# EAGLE board nixie-v-rev-b (EAGLE 9.6.2)
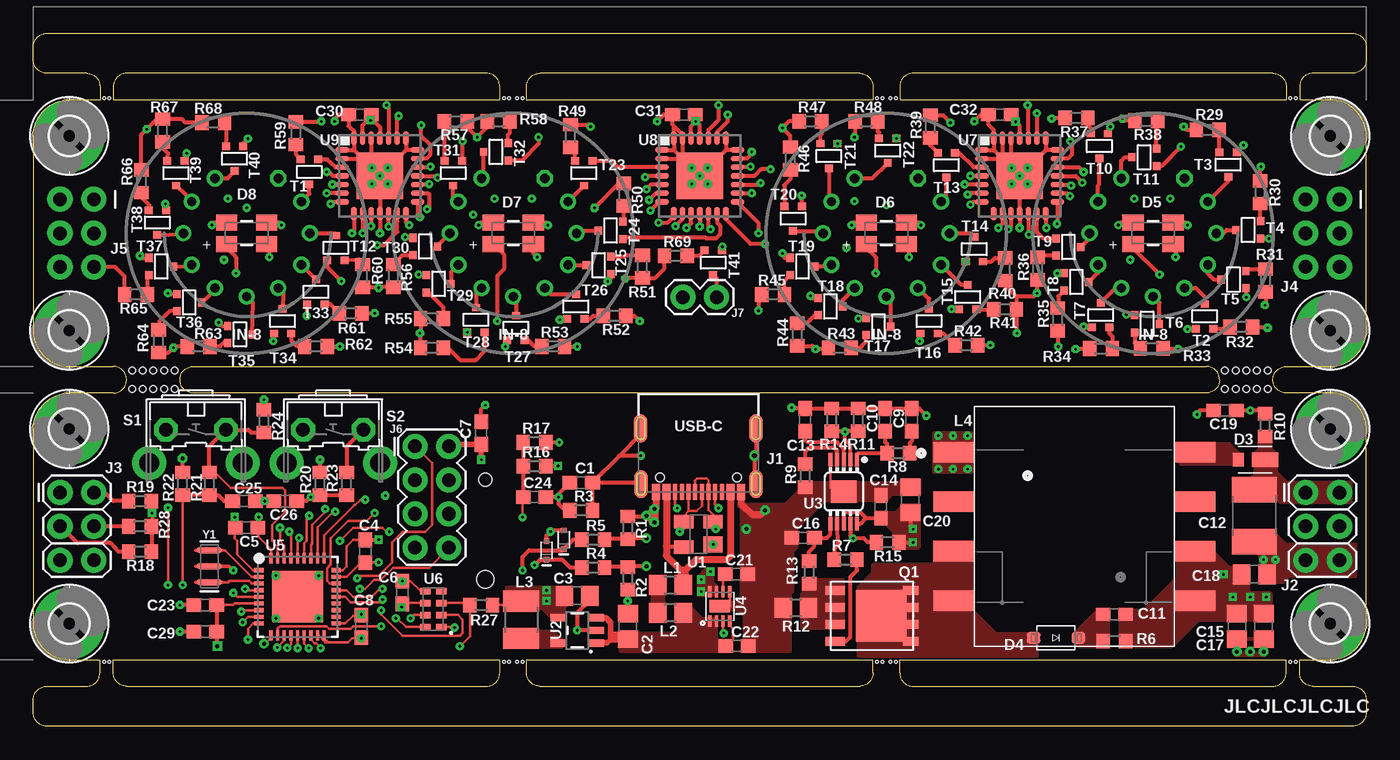
[diagram p5: board, top side]
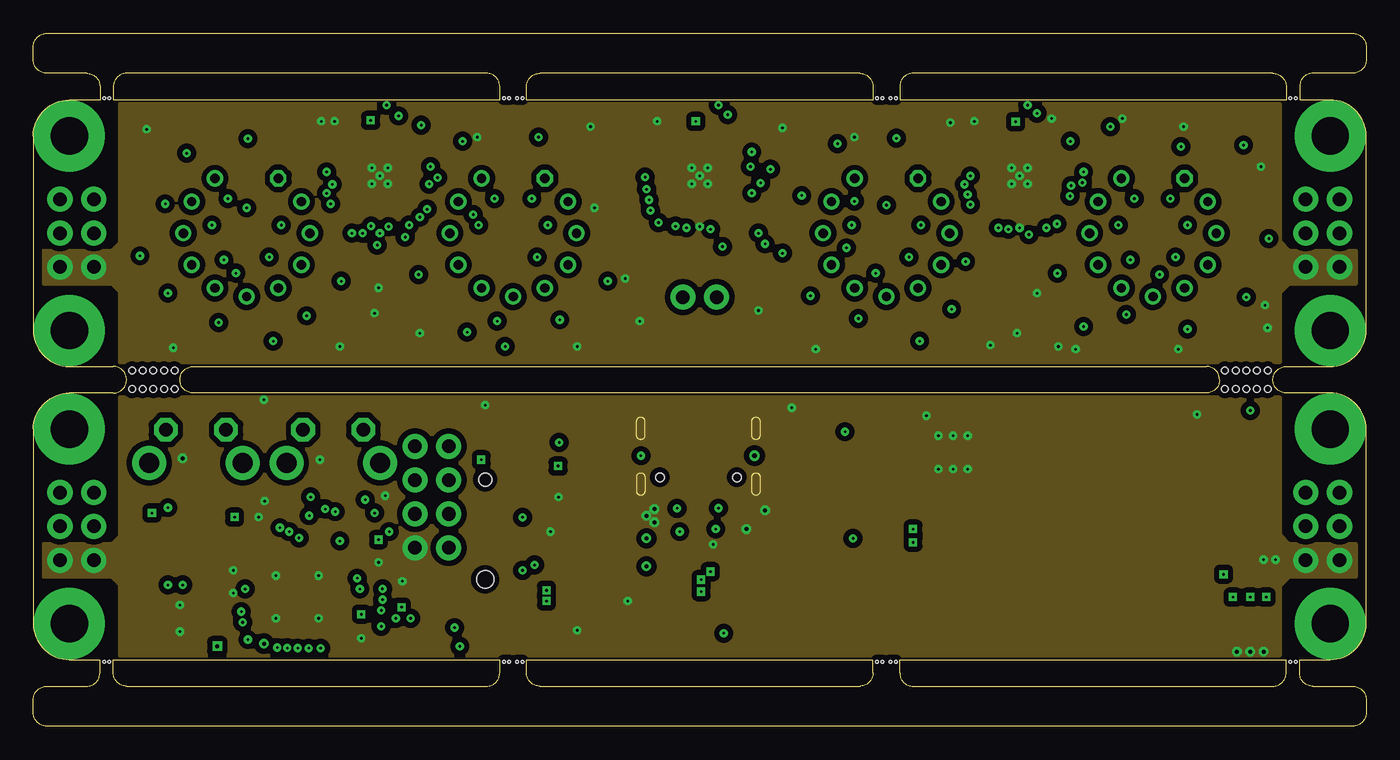
[diagram p6: board, inner layer Route2]
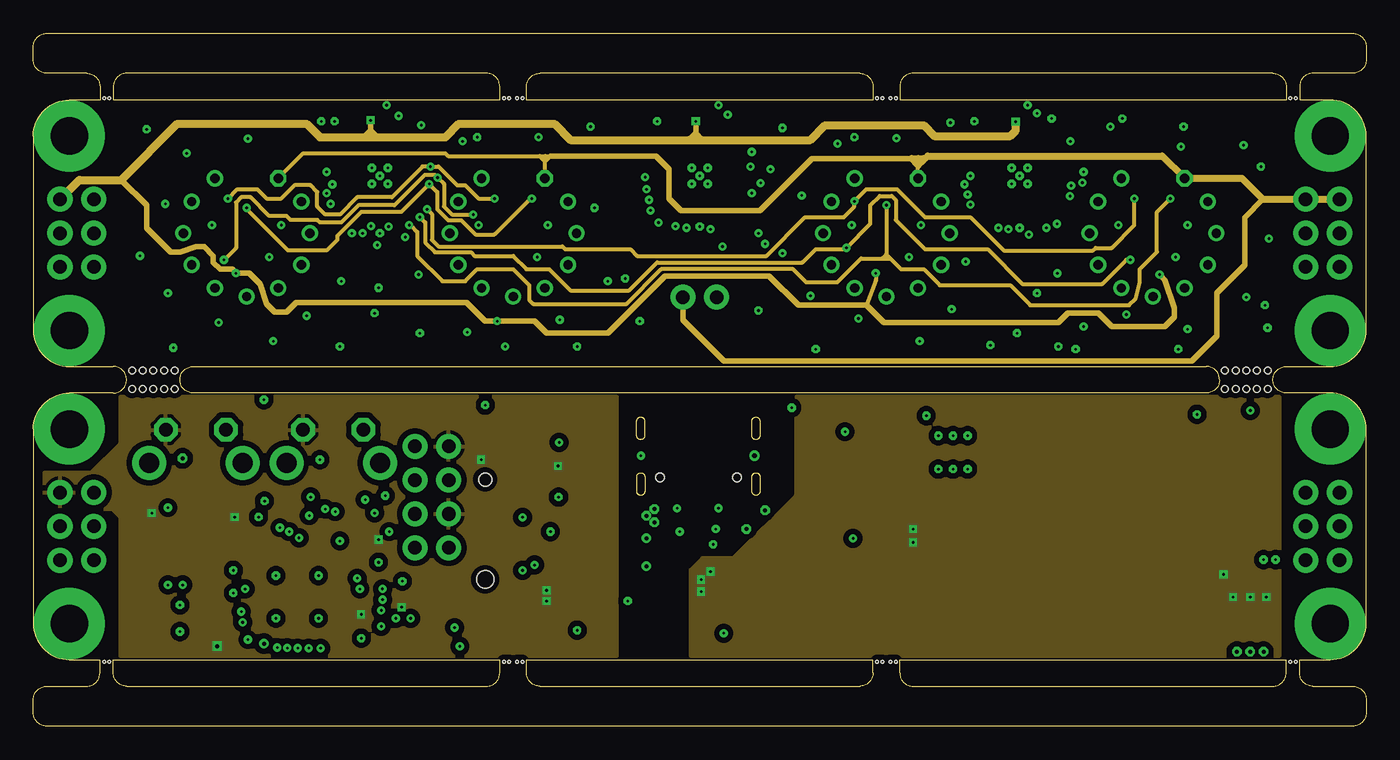
[diagram p7: board, inner layer Route15]
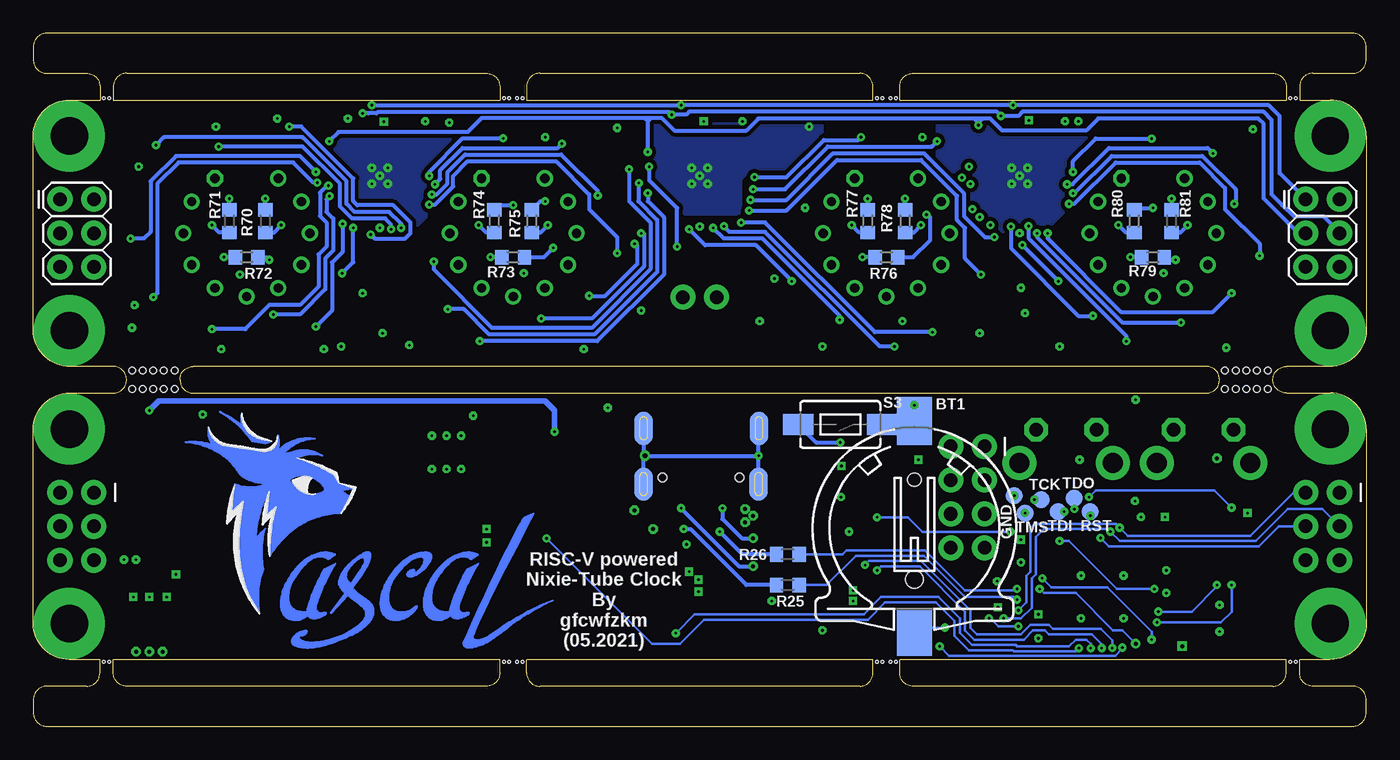
[diagram p8: board, bottom side, seen from below]

Size 100 x 52 mm. Coordinates in mm from the lower left corner, seen from the top.
Outline: 2.7,5 5,5 5,4 arc-90 4,3 1,3 arc90 0,2 0,1 arc90 1,0 99,0 arc90 100,1 100,2 arc90 99,3 96,3 arc-90 95,4 95,5 97.3,5 arc90 100,7.7 100,22.3 arc90 97.3,25 94,25 arc-90 93,26 arc-90 94,27 97.3,27 arc90 100,29.7 100,44.3 arc90 97.3,47 95,47 95,48 arc-90 96,49 99,49 arc90 100,50 100,51 arc90 99,52 1,52 arc90 0,51 0,50 arc90 1,49 4,49 arc-90 5,48 5,47 2.7,47 arc90 0,44.3 0,29.7 arc90 2.7,27 6,27 arc-90 7,26 arc-90 6,25 2.7,25 arc90 0,22.3 0,7.7 arc90 2.7,5
Outline: 6,5 35,5 35,4 arc-90 34,3 7,3 arc-90 6,4 6,5
Outline: 37,5 63,5 63,4 arc-90 62,3 38,3 arc-90 37,4 37,5
Outline: 65,5 94,5 94,4 arc-90 93,3 66,3 arc-90 65,4 65,5
Outline: 88,25 12,25 arc-90 11,26 arc-90 12,27 88,27 arc-90 89,26 arc-90 88,25
Outline: 94,47 65,47 65,48 arc-90 66,49 93,49 arc-90 94,48 94,47
Outline: 63,47 37,47 37,48 arc-90 38,49 62,49 arc-90 63,48 63,47
Outline: 35,47 6,47 6,48 arc-90 7,49 34,49 arc-90 35,48 35,47
Copper layers (1+2*15+16): Top 0.035mm / dielectric 0.2mm / Route2 0.035mm / dielectric 1mm / Route15 0.035mm / dielectric 0.2mm / Bottom 0.035mm
Design rules "jlcpcb_4_layers": minimum track width 5mil, minimum drill 0.2mm, track to track 5mil, track to pad 6mil, pad to pad 6mil, via to via 6mil, smd to smd 6mil, copper to edge 0mil, drill to drill 6mil, minimum pad ring 10mil, minimum via ring 8mil, stop-mask expansion 4mil, vias tented up to drill 0mil, thermal gap 10mil
Holes 0.5 mm at 7.4,25.3 8.2,25.3 9,25.3 9.8,25.3 10.6,25.3 89.4,25.3 90.2,25.3 91,25.3 91.8,25.3 92.6,25.3 89.4,26.7 90.2,26.7 91,26.7 91.8,26.7 92.6,26.7 7.4,26.7 8.2,26.7 9,26.7 9.8,26.7 10.6,26.7
Holes 0.2 mm at 5.3,47.15 5.7,47.15 94.3,47.15 94.7,47.15 63.3,47.15 63.7,47.15 64.3,47.15 64.7,47.15 35.3,47.15 35.7,47.15 36.3,47.15 36.7,47.15 94.7,4.85 94.3,4.85 5.7,4.85 5.3,4.85 36.7,4.85 36.3,4.85 35.7,4.85 35.3,4.85 64.7,4.85 64.3,4.85 63.7,4.85 63.3,4.85

## Footprints (pad centres in the part's own frame; a part is rotated, then mirrored left to right if it is on the bottom)
CH291-1220LF = smd 2.6 x 3.6: + 0,-7.9; - 0,7.9 | hole 1.3: 0,-3.98 | hole 1: 0,3.51
C0603 = smd 1.1 x 1: 1 -0.85,0; 2 0.85,0
C0805 = smd 1.3 x 1.5: 1 -0.95,0; 2 0.95,0
C1812 = smd 1.9 x 3.4: 1 -1.95,0; 2 1.95,0
SOD-523 = smd 0.4 x 0.4: A -0.7,0; C 0.7,0
MICROSMA = smd 0.8 x 1: A 1,0 | smd 2 x 1.1: C -1,0
SOD-123 = smd 1.02 x 0.86: A 1.68,0; C -1.68,0
WL-SFRW_1206_REC = smd 1.6 x 1.2: 1 -1.5,-0.8; 2 -1.5,0.8; 3 1.5,0.8; 4 1.5,-0.8
B1,27 = smd 1.27 x 1.27: TP 0,0
2,8-PAD = drill 2.8 pad 5.334: B2,8 0,0
USB4105-GF-A = smd 0.6 x 1.2: A1 -3.2,4.53; A4 -2.4,4.53; B1 3.2,4.53; B4 2.4,4.53 | smd 0.3 x 1.2: A5 -1.25,4.53; A6 -0.25,4.53; A7 0.25,4.53; A8 1.25,4.53; B5 1.75,4.53; B6 0.75,4.53; B7 -0.75,4.53; B8 -1.75,4.53 | smd 1.4 x 2.5 bottom: SHB1 -4.32,3.93; SHB2 -4.31,-0.25; SHB3 4.32,3.93; SHB4 4.33,-0.25 | smd 1 x 2.1: SHT1 -4.32,3.93; SHT2 -4.31,-0.25; SHT3 4.32,3.93; SHT4 4.33,-0.25 | hole 0.65: -2.89,3.43; 2.89,3.43
2X3 = drill 1.016 pad 1.88: 1 0,0; 2 0,2.54; 3 2.54,0; 4 2.54,2.54; 5 5.08,0; 6 5.08,2.54
2X4 = drill 1.016 pad 1.88: 1 -3.81,-1.27; 2 -3.81,1.27; 3 -1.27,-1.27; 4 -1.27,1.27; 5 1.27,-1.27; 6 1.27,1.27; 7 3.81,-1.27; 8 3.81,1.27
1X02 = drill 1.016 pad 1.88: 1 0,0; 2 2.54,0
R0805 = smd 1.3 x 1.5: 1 -0.95,0; 2 0.95,0
R1210 = smd 1.6 x 2.7: 1 -1.4,0; 2 1.4,0
750032050 = smd 3 x 1.55: 1 -9.075,5.565; 2 -9.075,1.855; 3 -9.075,-1.855; 4 -9.075,-5.565; 5 9.075,-5.565; 6 9.075,-1.855; 7 9.075,1.855; 8 9.075,5.565
IN-8 = drill 0.7: 0 -4.113,-2.375; 1 2.375,-4.113; 2 4.114,-2.375; 3 4.75,0; 4 4.113,2.375; 5 2.375,4.113; 6 0,4.75; 7 -2.375,4.113; 8 -4.113,2.375; 9 -4.75,0 | drill 0.7 octagon: A -2.375,-4.113
SO-08_POWERPAK = smd 1.47 x 0.635: 1 -2.64,1.905; 2 -2.64,0.635; 3 -2.64,-0.635; 4 -2.64,-1.905 | smd 1.22 x 0.635: 5 3.025,-1.905; 6 3.025,-0.635; 7 3.025,0.635; 8 3.025,1.905 | smd 3.81 x 3.91: THERMAL 0.82,0
R0603 = smd 1 x 1.1: 1 -0.85,0; 2 0.85,0
B3F-31XX = drill 1.016 pad 1.778 octagon: 1 -2.261,-1.245; 2 2.261,-1.245 | drill 1.499 pad 2.54: 3 -3.505,1.245; 4 3.505,1.245
TACTILE_SWITCH_SMD_6.0X3.5MM = smd 2.3 x 1.6: 1 -3.15,0; 2 3.15,0
SC70-3-R = smd 0.6 x 0.55: 1 -0.65,-0.925; 2 0.65,-0.925; 3 0,0.925
SOT143B = smd 1.2 x 1.44: 1 -0.75,-1.1 | smd 1 x 1.44: 2 0.95,-1.1; 3 0.95,1.1; 4 -0.95,1.1
TSOT23-5 = smd 0.55 x 1.2: 1 -0.95,-1.4; 2 0,-1.4; 3 0.95,-1.4; 4 0.95,1.4; 5 -0.95,1.4
MSOP10_POWER = smd 0.3 x 1.02: 1 -1,-2.4; 2 -0.5,-2.4; 3 0,-2.4; 4 0.5,-2.4; 5 1,-2.4; 6 1,2.4; 7 0.5,2.4; 8 0,2.4; 9 -0.5,2.4; 10 -1,2.4 | smd 1.88 x 1.68: EP 0,0
WSON-8 = smd 0.8 x 0.25: 1 -1.1,0.75; 2 -1.1,0.25; 3 -1.1,-0.25; 4 -1.1,-0.75; 5 1.1,-0.75; 6 1.1,-0.25; 7 1.1,0.25; 8 1.1,0.75 | smd 0.9 x 1.6: TP 0,0
QFN-36 = smd 0.7 x 0.25: 1 -2.9,2; 2 -2.9,1.5; 3 -2.9,1; 4 -2.9,0.5; 5 -2.9,0; 6 -2.9,-0.5; 7 -2.9,-1; 8 -2.9,-1.5; 9 -2.9,-2; 19 2.9,-2; 20 2.9,-1.5; 21 2.9,-1; 22 2.9,-0.5; 23 2.9,0; 24 2.9,0.5; 25 2.9,1; 26 2.9,1.5; 27 2.9,2 | smd 0.25 x 0.7: 10 -2,-2.9; 11 -1.5,-2.9; 12 -1,-2.9; 13 -0.5,-2.9; 14 0,-2.9; 15 0.5,-2.9; 16 1,-2.9; 17 1.5,-2.9; 18 2,-2.9; 28 2,2.9; 29 1.5,2.9; 30 1,2.9; 31 0.5,2.9; 32 0,2.9; 33 -0.5,2.9; 34 -1,2.9; 35 -1.5,2.9; 36 -2,2.9 | smd 3.9 x 3.9: EP 0,0
RV-3028-C7 = smd 0.5 x 0.8: 1 -1.35,-0.6; 2 -0.45,-0.6; 3 0.45,-0.6; 4 1.35,-0.6; 5 1.35,0.6; 6 0.45,0.6; 7 -0.45,0.6; 8 -1.35,0.6
HVQFN28 = smd 1 x 0.4: 1 -2.825,1.95; 2 -2.825,1.3; 3 -2.825,0.65; 4 -2.825,0; 5 -2.825,-0.65; 6 -2.825,-1.3; 7 -2.825,-1.95; 15 2.825,-1.95; 16 2.825,-1.3; 17 2.825,-0.65; 18 2.825,0; 19 2.825,0.65; 20 2.825,1.3; 21 2.825,1.95 | smd 0.4 x 1: 8 -1.95,-2.825; 9 -1.3,-2.825; 10 -0.65,-2.825; 11 0,-2.825; 12 0.65,-2.825; 13 1.3,-2.825; 14 1.95,-2.825; 22 1.95,2.825; 23 1.3,2.825; 24 0.65,2.825; 25 0,2.825; 26 -0.65,2.825; 27 -1.3,2.825; 28 -1.95,2.825 | smd 3.5 x 3.5: TH 0,0
RESONATOR-SMD-3.2X1.3 = smd 0.45 x 1.905: 1 -1.2,0; 2 0,0; 3 1.2,0

## Placement (x,y rotation side)
BT1  3v 1220 Battery  [CH291-1220LF]  33.9,15 0 bottom
C1  100nF  [C0603]  41.11,18.29 180 top
C2  4.7uF  [C0805]  44.6,7.5 90 top
C3  10uF  [C0805]  40.8,9.8 0 top
C4  1uF  [C0603]  24.91,13.13 270 top
C5  1uF  [C0603]  16,14.9 0 top
C6  1uF  [C0603]  27.69,10.03 90 top
C7  1uF  [C0603]  33.6,22 90 top
C8  1uF  [C0603]  24.6,7.5 270 top
C9  22nF  [C0603]  65.9,23 90 top
C10  100pF  [C0603]  63.9,23 90 top
C11  2.2nF  [C0603]  81.1,8.4 180 top
C12  470nF  [C1812]  91.6,15.8 270 top
C13  22nF  [C0603]  57.9,23 90 top
C14  1uF  [C0603]  63.59,16.47 90 top
C15  22uF  [C0805]  90.3,7.5 270 top
C16  3.3nF  [C0603]  57.75,14.14 180 top
C17  22uF  [C0805]  92.3,7.5 270 top
C18  22uF  [C0805]  91.6,11.4 0 top
C19  6.8pF  [C0603]  89.4,23.7 180 top
C20  22uF  [C0805]  65.8,17 90 top
C21  680pF  [C0603]  52.75,11.41 0 top
C22  1uF  [C0603]  52.79,6.02 0 top
C23  10nF  [C0603]  12.9,9.1 180 top
C24  100nF  [C0603]  37.6,17.2 0 top
C25  100nF  [C0603]  15.8,16.9 0 top
C26  100nF  [C0603]  18.9,16.9 180 top
C29  1uF  [C0603]  12.9,7.1 180 top
C30  1uF  [C0603]  24.5,45.9 180 top
C31  1uF  [C0603]  48.8,45.9 180 top
C32  1uF  [C0603]  72.5,45.9 180 top
D1  3V  [SOD-523]  39.8,14 270 top
D2  3V  [SOD-523]  38.5,13.2 270 top
D3  ESH1JMRSG  [MICROSMA]  91.4,19.99 180 top
D4  MBR0520LT1G  [SOD-123]  76.73,6.63 180 top
D5  [WL-SFRW_1206_REC]  84,37 0 top
D6  [WL-SFRW_1206_REC]  64,37 0 top
D7  [WL-SFRW_1206_REC]  36,37 0 top
D8  [WL-SFRW_1206_REC]  16,37 0 top
GND  TPB1,27  [B1,27]  26.4,17.3 0 bottom
H1  MOUNT-PAD-ROUND2.8  [2,8-PAD]  97.3,22.3 0 top
H2  MOUNT-PAD-ROUND2.8  [2,8-PAD]  97.3,7.7 0 top
H3  MOUNT-PAD-ROUND2.8  [2,8-PAD]  97.3,44.3 0 top
H4  MOUNT-PAD-ROUND2.8  [2,8-PAD]  97.3,29.7 0 top
H5  MOUNT-PAD-ROUND2.8  [2,8-PAD]  2.7,7.7 0 top
H6  MOUNT-PAD-ROUND2.8  [2,8-PAD]  2.7,22.3 0 top
H7  MOUNT-PAD-ROUND2.8  [2,8-PAD]  2.7,44.3 0 top
H8  MOUNT-PAD-ROUND2.8  [2,8-PAD]  2.7,29.7 0 top
J1  USB41XX-GF-AMIXED  [USB4105-GF-A]  49.9,22.1 180 top
J2  ToUpperPCB  [2X3]  95.46,17.54 270 top
J3  ToUpperPCB  [2X3]  2,17.54 270 top
J4  FromLowerPCB  [2X3]  98,39.54 270 bottom
J5  FromLowerPCB  [2X3]  4.54,39.54 270 bottom
J6  ESP-01  [2X4]  29.9,17.2 270 top
J7  [1X02]  48.73,32.2 0 top
L1  Ih 750mA  [R0805]  47.8,10.6 0 top
L2  f-bead  [R0805]  47.8,8.5 180 top
L3  4.7uH  [R1210]  36.6,8 270 top
L4  750032050  [750032050]  78.1,15 0 top
N1  Single Minutes  [IN-8]  84,37 180 top
N2  Tens Minutes  [IN-8]  64,37 180 top
N3  Singe Hours  [IN-8]  36,37 180 top
N4  Tens Hours  [IN-8]  16,37 180 top
Q1  SIR170DP  [SO-08_POWERPAK]  62.8,8.28 0 top
R1  5.1k  [R0603]  44.6,14.9 270 top
R2  5.1k  [R0603]  44.6,11.1 90 top
R3  10k  [R0603]  41.11,16.2 0 top
R4  100  [R0603]  42,11.9 180 top
R5  100  [R0603]  42,14 180 top
R6  10k  [R0603]  81.1,6.4 0 top
R7  10  [R0603]  60.94,12.5 0 top
R8  10k  [R0603]  64.9,20.5 180 top
R9  30.9k  [R0603]  57.9,18.8 90 top
R10  1.05M  [R0603]  92.4,22.6 270 top
R11  10.5k  [R0603]  61.9,23 270 top
R12  20m  [R0805]  57.2,8.9 0 top
R13  10  [R0603]  58.2,11.55 270 top
R14  180k  [R0603]  59.9,23 270 top
R15  10k  [R0603]  64.1,13.8 0 top
R16  10k  [R0603]  37.6,19.51 0 top
R17  330  [R0603]  37.59,21.3 180 top
R18  3.3k  [R0603]  8,13.1 0 top
R19  3.3k  [R0603]  8,16.9 0 top
R20  10k  [R0603]  21.5,18.2 270 top
R21  330  [R0603]  13.2,18.2 90 top
R22  10k  [R0603]  11.2,18.2 270 top
R23  330  [R0603]  23.5,18.2 90 top
R24  100k  [R0603]  17.3,22.9 270 top
R25  22  [R0603]  43.4,10.6 180 bottom
R26  22  [R0603]  43.4,12.9 180 bottom
R27  3.3k  [R0603]  33.6,9.1 0 top
R28  3.3k  [R0603]  8,15 0 top
R29  1.3k  [R0603]  88.11,44.74 0 top
R30  1.3k  [R0603]  92.04,40.07 270 top
R31  1.3k  [R0603]  92.46,33.45 90 top
R32  1.3k  [R0603]  90.63,29.96 180 top
R33  1.3k  [R0603]  83.91,28.36 180 top
R34  1.3k  [R0603]  80.11,28.34 0 top
R35  1.3k  [R0603]  76.86,30.53 90 top
R36  1.3k  [R0603]  75.36,34.35 90 top
R37  1.3k  [R0603]  78.27,45.64 0 top
R38  1.3k  [R0603]  83.49,45.44 0 top
R39  1.3k  [R0603]  67.3,45 270 top
R40  1.3k  [R0603]  72.9,34.3 90 top
R41  1.3k  [R0603]  72.9,31.3 180 top
R42  1.3k  [R0603]  70,28.6 180 top
R43  1.3k  [R0603]  60.5,28.4 0 top
R44  1.3k  [R0603]  57.3,29.4 90 top
R45  1.3k  [R0603]  55.5,32.4 0 top
R46  1.3k  [R0603]  56.8,42.6 270 top
R47  1.3k  [R0603]  58.3,45.4 0 top
R48  1.3k  [R0603]  62.5,45.4 0 top
R49  1.3k  [R0603]  40.3,44.3 270 top
R50  1.3k  [R0603]  44.3,39.9 270 top
R51  1.3k  [R0603]  45.7,34.5 90 top
R52  1.3k  [R0603]  43.6,30.8 180 top
R53  1.3k  [R0603]  39,28.5 180 top
R54  1.3k  [R0603]  29.9,28.4 0 top
R55  1.3k  [R0603]  29.9,30.6 0 top
R56  1.3k  [R0603]  27,33.8 90 top
R57  1.3k  [R0603]  31.7,45.4 180 top
R58  1.3k  [R0603]  34.9,45.4 0 top
R59  1.3k  [R0603]  19.7,44.5 270 top
R60  1.3k  [R0603]  24.7,33.8 90 top
R61  1.3k  [R0603]  23.8,31 180 top
R62  1.3k  [R0603]  21.2,28.5 180 top
R63  1.3k  [R0603]  12.4,28.5 0 top
R64  1.3k  [R0603]  9.4,28.9 90 top
R65  1.3k  [R0603]  7.7,32.4 0 top
R66  1.3k  [R0603]  8.1,40.9 270 top
R67  1.3k  [R0603]  9.7,44.7 270 top
R68  1.3k  [R0603]  13.5,45.3 0 top
R69  5.4k  [R0603]  48.2,35.3 0 top
R70  10  [R0603]  82.6,37.9 90 bottom
R71  191  [R0603]  85.3,37.9 90 bottom
R72  115  [R0603]  84,35.2 0 bottom
R73  115  [R0603]  64,35.2 0 bottom
R74  191  [R0603]  65.4,37.9 90 bottom
R75  10  [R0603]  62.6,37.9 90 bottom
R76  115  [R0603]  36,35.2 0 bottom
R77  191  [R0603]  37.4,37.9 90 bottom
R78  10  [R0603]  34.6,37.9 90 bottom
R79  115  [R0603]  16,35.2 0 bottom
R80  191  [R0603]  17.4,37.9 90 bottom
R81  10  [R0603]  14.6,37.9 90 bottom
RST  TPB1,27  [B1,27]  20.7,16.1 0 bottom
S1  Set  [B3F-31XX]  12.2,21 180 top
S2  Count  [B3F-31XX]  22.5,21 180 top
S3  Reset  [TACTILE_SWITCH_SMD_6.0X3.5MM]  39.46,22.64 180 bottom
T1  MSD42WT1G  [SC70-3-R]  20.7,41.6 180 top
T2  MSD42WT1G  [SC70-3-R]  87.88,30.76 0 top
T3  MSD42WT1G  [SC70-3-R]  89.64,42.14 180 top
T4  MSD42WT1G  [SC70-3-R]  91.14,37.24 90 top
T5  MSD42WT1G  [SC70-3-R]  90.04,33.52 90 top
T6  MSD42WT1G  [SC70-3-R]  83.56,30.2 270 top
T7  MSD42WT1G  [SC70-3-R]  80.08,30.86 0 top
T8  MSD42WT1G  [SC70-3-R]  78.26,33.34 270 top
T9  MSD42WT1G  [SC70-3-R]  77.66,35.96 270 top
T10  MSD42WT1G  [SC70-3-R]  79.98,43.54 180 top
T11  MSD42WT1G  [SC70-3-R]  83.34,42.7 90 top
T12  MSD42WT1G  [SC70-3-R]  22.7,35.9 0 top
T13  MSD42WT1G  [SC70-3-R]  68.5,42.1 180 top
T14  MSD42WT1G  [SC70-3-R]  70.6,35.8 0 top
T15  MSD42WT1G  [SC70-3-R]  70.1,32.2 0 top
T16  MSD42WT1G  [SC70-3-R]  67.2,30.4 0 top
T17  MSD42WT1G  [SC70-3-R]  63.4,30 270 top
T18  MSD42WT1G  [SC70-3-R]  59.8,31.5 270 top
T19  MSD42WT1G  [SC70-3-R]  57.7,34.5 270 top
T20  MSD42WT1G  [SC70-3-R]  57,38.1 180 top
T21  MSD42WT1G  [SC70-3-R]  59.69,42.79 180 top
T22  MSD42WT1G  [SC70-3-R]  64.1,43.2 180 top
T23  MSD42WT1G  [SC70-3-R]  41.3,41.5 180 top
T24  MSD42WT1G  [SC70-3-R]  43.3,37.2 90 top
T25  MSD42WT1G  [SC70-3-R]  42.4,34.6 90 top
T26  MSD42WT1G  [SC70-3-R]  40.7,31.5 0 top
T27  MSD42WT1G  [SC70-3-R]  36.2,29.9 0 top
T28  MSD42WT1G  [SC70-3-R]  33.2,30.5 0 top
T29  MSD42WT1G  [SC70-3-R]  30.4,33.2 270 top
T30  MSD42WT1G  [SC70-3-R]  29.4,36 270 top
T31  MSD42WT1G  [SC70-3-R]  31.5,41.5 180 top
T32  MSD42WT1G  [SC70-3-R]  34.7,43.1 90 top
T33  MSD42WT1G  [SC70-3-R]  21.2,32.6 0 top
T34  MSD42WT1G  [SC70-3-R]  18.7,30.4 0 top
T35  MSD42WT1G  [SC70-3-R]  15.5,29.4 270 top
T36  MSD42WT1G  [SC70-3-R]  11.7,31.8 270 top
T37  MSD42WT1G  [SC70-3-R]  9.6,34.5 270 top
T38  MSD42WT1G  [SC70-3-R]  9.3,37.8 180 top
T39  MSD42WT1G  [SC70-3-R]  10.7,41.5 180 top
T40  MSD42WT1G  [SC70-3-R]  15.1,42.6 180 top
T41  MSD42WT1G  [SC70-3-R]  51,34.8 180 top
TCK  TPB1,27  [B1,27]  24.4,17 0 bottom
TDI  TPB1,27  [B1,27]  23.1,16.1 0 bottom
TDO  TPB1,27  [B1,27]  21.9,17.1 0 bottom
TMS  TPB1,27  [B1,27]  25.6,16 0 bottom
U1  PRTR5V0U2X  [SOT143B]  49.9,14.4 90 top
U2  MCP1603  [TSOT23-5]  40.8,7.2 90 top
U3  LT3757A_MSOP  [MSOP10_POWER]  60.8,17.6 180 top
U4  TPS22965  [WSON-8]  51.5,9 90 top
U5  GD32VF103T  [QFN-36]  19.83,9.71 0 top
U6  RV-3032-C7  [RV-3028-C7]  30,8.8 90 top
U7  PCA9685BS  [HVQFN28]  74,41.3 0 top
U8  PCA9685BS  [HVQFN28]  50,41.3 0 top
U9  PCA9685BS  [HVQFN28]  26,41.3 0 top
U$1  LOGO_PASCAL_GESELL30MM  [LOGO_30MM]  90.71,2.77 0 bottom
U$2  LOGO_PASCAL_GESELLEMPTY  [EMPTY]  48.89,20.81 0 top
U$3  LOGO_PASCAL_GESELLEMPTY  [EMPTY]  47.25,21.71 0 top
U$4  LOGO_PASCAL_GESELLEMPTY  [EMPTY]  48.31,21.21 0 top
U$5  LOGO_PASCAL_GESELLEMPTY  [EMPTY]  47.77,22.51 0 top
Y1  8MHz  [RESONATOR-SMD-3.2X1.3]  13.2,12 270 top

## Tracks (layer width: path | path; a pad name or v marks a point on that pad's centre or on a via)
00  (via drill 0.2)
  Top 0.305: U7.9 72.7,37.7 v72.4,37.4 | v90.8,43.6 90.8,43.58 T3.1
  Bottom 0.305: v72.4,37.4 72.4,37.7 73.3,38.6 75.9,38.6 76.5,39.2 76.5,40.9 79.8,44.2 90.2,44.2 v90.8,43.6
01  (via drill 0.2)
  Top 0.305: U7.10 73.35,37.49 v73.16,37.3 | v86.1,43.5 84.65,42.05 T11.1
  Bottom 0.305: v73.16,37.3 73.16,37.66 73.6,38.1 76.1,38.1 77,39 77,40.7 79.8,43.5 v86.1,43.5
02  (via drill 0.2)
  Top 0.305: U7.12 74.65,36.94 v74.69,36.9 | v80.8,45 80.63,44.83 T10.1
  Bottom 0.305: v74.69,36.9 74.39,36.6 72.1,36.6 71.7,37 71.7,37.8 73,39.1 75.69,39.1 76,39.41 76,41.1 79.9,45 v80.8,45
03
  Top 0.305: T9.1 75.79,36.61 75.3,37.1 U7.13
04  (via drill 0.2)
  Top 0.305: U7.14 75.95,37.45 v76,37.4 | T8.1 v76.83,33.99
  Bottom 0.305: v76.83,33.99 76,34.83 v76,37.4
05  (via drill 0.2)
  Top 0.305: U7.15 76.83,37.73 v76.8,37.7 | v78.8,30 78.86,29.93 T7.1
  Bottom 0.305: v76.8,37.7 76.8,35.6 77.6,34.8 77.6,31.2 v78.8,30
06  (via drill 0.2)
  Top 0.305: U7.16 77.55,40 v77.78,39.78 | v82,30.9 82.05,30.85 T6.1
  Bottom 0.305: v77.78,39.78 78,39.55 78,38.6 77.5,38.1 77.5,35.7 78.1,35.1 78.1,32.8 80,30.9 v82,30.9
07  (via drill 0.2)
  Top 0.305: U7.17 77.78,40.65 v77.86,40.56 | v86.6,29.8 86.64,29.84 T2.1
  Bottom 0.305: v77.86,40.56 77.96,40.56 78.5,40.03 78.5,38.3 78,37.8 78,36 78.6,35.4 78.6,33 79.99,31.61 82.29,31.61 84.1,29.8 v86.6,29.8
08  (via drill 0.2)
  Top 0.305: U7.18 78.2,41.3 v78.7,40.8 | v91,32.2 91,32.84 T5.1
  Bottom 0.305: v78.7,40.8 79,40.8 80.5,42.3 89.1,42.3 90.7,40.7 90.7,32.5 v91,32.2
09  (via drill 0.2)
  Top 0.305: U7.19 78.45,41.95 v78.8,41.6 | v92.7,36.6 v92.69,36.59 T4.1
  Bottom 0.305: v78.8,41.6 80,42.8 89.3,42.8 91.2,40.9 91.2,37.1 91.7,36.6 v92.7,36.6
10
  Top 0.305: U7.3 70.55,41.95 69.47,43.02 T13.1
11  (via drill 0.2)
  Top 0.305: U7.4 v70.3,41.3
  Bottom 0.305: v70.3,41.3 70.3,41.6 67.78,44.12 T22.1
  other vias: 64.75,44.12
12  (via drill 0.2)
  Top 0.305: U7.5 69.88,40.65 v69.86,40.66
  Bottom 0.305: v69.86,40.66 69.46,41.06 69.46,41.74 67.8,43.4 60.66,43.4 v60.34,43.72
13  (via drill 0.2)
  Top 0.305: U7.6 70.19,40 v70.1,39.91 | T20.1 v57.65,39.83
  Bottom 0.305: v70.1,39.91 69.76,39.91 68.93,40.73 68.93,41.57 67.6,42.9 60.4,42.9 57.65,40.15 v57.65,39.83
14  (via drill 0.2)
  Top 0.305: U7.7 70.5,39.35 v70.3,39.15 | v56.2,35.5 56.2,35.33 56.38,35.15 T19.1
  Bottom 0.305: v70.3,39.15 69.85,39.15 68.5,40.5 68.5,41.3 67.4,42.4 60.8,42.4 58.3,39.9 58.3,38.8 56.2,36.7 v56.2,35.5
15  (via drill 0.2)
  Top 0.305: U8.14 51.95,38.05 53.8,36.2 v54.9,36.2 | v58.3,32.3 58.45,32.15 T18.1
  Bottom 0.305: v54.9,36.2 54.7,36 54.7,34.7 57.1,32.3 v58.3,32.3
16  (via drill 0.2)
  Top 0.305: v61.9,30.6 61.95,30.65 T17.1 | U8.15 54.4,37.77 v54.4,37
  Bottom 0.305: v54.4,37 54.2,37 54.2,34.5 58.1,30.6 v61.9,30.6
17  (via drill 0.2)
  Top 0.305: U8.16 v53.9,40 v53.9,40.01 | v66.5,28.9 66.55,28.95 T16.1
  Bottom 0.305: v53.9,40.01 53.9,39.4 52.7,38.2 52.7,33.9 57.7,28.9 v66.5,28.9
18  (via drill 0.2)
  Top 0.305: U8.17 54.45,40.65 v54.56,40.76 | v68.9,31.3 69.42,31.3 T15.1
  Bottom 0.305: v54.56,40.76 54.6,40.73 54.6,39.4 53.2,38 53.2,34.1 57.9,29.4 65.8,29.4 67.7,31.3 v68.9,31.3
19  (via drill 0.2)
  Top 0.305: v55.3,41.8 54.6,41.8 54.1,41.3 U8.18
  Bottom 0.305: v55.3,41.8 55.3,39.4 53.7,37.8 53.7,34.3 58.1,29.9 65.58,29.9 69.95,34.27 T14.1
  other vias: 69.95,34.88
20
  Top 0.305: U8.3 43.85,41.95 43.38,42.42 T23.1
21  (via drill 0.2)
  Top 0.305: U8.4 46,41.3 v45.9,41.2 | v37.9,44.2 37.9,43.7 36.65,42.45 T32.1
  Bottom 0.305: v45.9,41.2 43.5,41.2 40.7,44 38.1,44 v37.9,44.2
22  (via drill 0.2)
  Top 0.305: U8.5 46.35,40.65 v46,40.3 | v32.2,43.9 32.15,43.85 T31.1
  Bottom 0.305: v46,40.3 43.6,40.3 40.4,43.5 32.6,43.5 v32.2,43.9
23  (via drill 0.2)
  Top 0.305: U8.6 46.7,40 v46.2,39.5 | v27.9,36.7 27.95,36.65 T30.1
  Bottom 0.305: v46.2,39.5 43.5,39.5 40,43 33.2,43 30.15,39.95 30.15,38.25 28.6,36.7 v27.9,36.7
24  (via drill 0.2)
  Top 0.305: U8.7 46.95,39.35 v46.3,38.7 | v28.9,33.9 28.95,33.85 T29.1
  Bottom 0.305: v46.3,38.7 43.5,38.7 39.7,42.5 33.4,42.5 30.7,39.8 30.7,38 30.1,37.4 30.1,35.1 v28.9,33.9
25  (via drill 0.2)
  Top 0.305: v46.9,37.8 47.6,37.8 48.05,38.25 U8.8
  Bottom 0.305: T28.1 36.88,29.57 45.1,37.8 v46.9,37.8
  other vias: 32.55,29.57
26  (via drill 0.2)
  Top 0.305: T27.1 35.55,28.65 v35.4,28.5 | v48.18,37.52 48.7,38.04 U8.9
  Bottom 0.305: v35.4,28.5 36.5,28.5 45.1,37.1 47.76,37.1 v48.18,37.52
27  (via drill 0.2)
  Top 0.305: T26.1 39.98,30.5 v39.5,30.5 | v49,37.4 49.35,37.75 U8.10
  Bottom 0.305: v39.5,30.5 39.5,30.8 45.3,36.6 48.2,36.6 v49,37.4
28  (via drill 0.2)
  Top 0.305: T25.1 43.33,33.62 v43.1,33.4 | v50.8,37.3 50.65,37.45 U8.12
  Bottom 0.305: v43.1,33.4 45.8,36.1 49.6,36.1 v50.8,37.3
29
  Top 0.305: U8.13 51.3,37.8 51.5,37.6 51.5,36.9 51.2,36.6 50.5,36.6 50.4,36.7 44.38,36.7 T24.1
30
  Top 0.305: U9.3 22.66,41.95 22.05,42.52 T1.1
31  (via drill 0.2)
  Top 0.305: U9.4 22.48,41.3 22.18,41.6 v22,41.6 | v16.1,44.1 15.75,43.75 T40.1
  Bottom 0.305: v22,41.6 22,42.4 20.3,44.1 v16.1,44.1
32  (via drill 0.2)
  Top 0.305: U9.5 v22.45,40.65 v22.44,40.66 | v11.5,43 11.35,42.85 T39.1
  Bottom 0.305: v22.44,40.66 22.04,40.66 19.3,43.4 11.9,43.4 v11.5,43
33  (via drill 0.2)
  Top 0.305: U9.6 v22,40 | v9.9,39.2 9.95,39.15 T38.1
  Bottom 0.305: v22,40 21.9,40 19.1,42.8 12.3,42.8 9.8,40.3 9.8,39.3 v9.9,39.2
34  (via drill 0.2)
  Top 0.305: U9.7 22.45,39.35 v22.3,39.2 | v8,35.3 8.15,35.15 T37.1
  Bottom 0.305: v22.3,39.2 21.9,39.2 18.8,42.3 12.5,42.3 10.6,40.4 10.6,38.8 8,36.2 v8,35.3
35  (via drill 0.2)
  Top 0.305: U9.8 24.05,37.15 v23.9,37 | v10.1,32.5 10.15,32.45 T36.1
  Bottom 0.305: v23.9,37 23.9,36.6 18.4,31.1 11.5,31.1 v10.1,32.5
36  (via drill 0.2)
  Top 0.305: U9.9 v24.7,37 | v13.9,30.3 14.15,30.05 T35.1
  Bottom 0.305: v24.7,37 24.7,36.7 18.3,30.3 v13.9,30.3
37  (via drill 0.2)
  Top 0.305: U9.10 v25.35,37.55 v25.34,37.54 | v18,28.9 18.05,28.95 T34.1
  Bottom 0.305: v25.34,37.54 25.34,36.64 18,29.3 v18,28.9
38  (via drill 0.2)
  Top 0.305: v20.5,30.8 20.55,30.85 T33.1 | v26.65,37.5 U9.12
  Bottom 0.305: v26.65,37.5 26.65,35.9 21.6,30.8 v20.5,30.8
39  (via drill 0.2)
  Top 0.305: T12.1 22.05,34.45 v23.1,33.4 | v25.8,36.1 26.3,36.1 27.31,37.11 27.31,37.89 27.3,37.9 U9.13
  Bottom 0.305: v23.1,33.4 v25.8,36.1
!OE  (via drill 0.2)
  Top 0.203: U5.32 19.83,14.03 v19.94,14.14
  Top 0.305: R28.1 J3.4
  Bottom 0.203: v19.94,14.14 19.3,13.5 8.04,13.5 6.54,15 J3.4
+3V3  (via drill 0.2, 0.3)
  Top 0.203: U5.1 16.49,11.71 15.3,12.9 15.3,13.9 15.1,14.1 15.1,14.85 C5.1 | U5.6 15.11,9.21 15,9.1 C23.1 | U5.19 23.41,7.71 24,8.3 C8.1 | U5.27 23.21,11.71 23.5,12 23.5,13.5 23.98,13.98 C4.1 | U6.6 27.76,9.25 C6.1 27.69,8.99 v27.62,8.93 | R27.2 36.3,9.1 L3.1
  Top 0.305: C5.1 15.15,15.65 v15.1,15.7 | C23.1 C29.1 13.75,6.05 v13.8,6 | C8.1 v24.6,8.4 | C4.1 24.93,14 v25.9,14 | R19.2 8.9,16.85 v8.9,16 8.9,15.05 R28.2 | R28.2 8.85,15.05 | R18.2 8.9,13.15 8.9,14.95 R28.2 | R16.2 38.46,19.53 v39.37,19.53
  Top 0.406: v33.6,20 C7.1 31.31,21.15 J6.2
  other vias: 38.5,9.4 38.5,10.2
  pour Top (no thermals): 39.8,8.1 39.8,8.9 40.1,9.2 40.1,10.4 35.5,10.4 35.5,8.9 38.2,8.9 39,8.1
  pour Route15 (isolate 0.406): 6.5,24.7 6.5,21.2 4.3,19 0.8,19 0.8,16.3 5.9,16.3 6.5,15.7 6.5,5.3 43.8,5.3 43.8,24.7
+5V
  Top 0.203: U4.4 52.25,7.55 52.5,7.3 52.5,6.58 C22.1
  Top 0.406: U2.3 42.95,8.15 43.3,7.8 43.3,6.9 | U2.1 43.05,6.25 43.3,6.5 | 44.55,6.5 C2.1 44.58,6.57 | 43.3,6.9 43.3,6.5 | 43.3,6.9 44.2,6.9 44.58,6.57 | 43.3,6.5 44.58,6.5 44.58,6.57
  pour Top (no thermals): 44,7 48,7 48.3,7.3 48.3,9 49.3,9 50.2,8.1 51.26,8.1 51.26,6.68 51.41,6.5 52.3,6.5 52.3,5.6 44,5.6
+170VDC
  Route15 0.305: N4.A 20.26,43 30.9,43 31.1,42.8 38,42.8 | N2.A 66.38,42.1 | N3.A 38.38,42.38 | 38.38,42.38 38.8,42.8 38.4,42.8 | 38,42.8 38.4,42.8 | 38.38,42.38 38.38,42.77 38.4,42.8 | 38.38,42.38 38,42.75 38,42.8
  Route15 0.406: 38.8,42.8 46.7,42.8 47.7,41.8 47.7,39.6 48.6,38.7 54.5,38.7 58.4,42.6 65.9,42.6 | 92.26,39.54 90.9,38.18 90.9,34.6 88.8,32.5 88.8,29.3 86.9,27.4 51.8,27.4 48.73,30.47 J7.1
  Route15 0.508: 66.4,42.6 65.9,42.6 66.38,42.12 | 66.4,42.6 66.8,42.6 | 66.8,42.6 66.9,42.6 67.1,42.8 84.69,42.8 N1.A 90.69,41.11 92.26,39.54 J4.2 J4.1 | 66.38,42.12 66.38,42.58 66.4,42.6 | 66.38,42.12 66.38,42.1 66.8,42.52 66.8,42.6
AGND  (via drill 0.2)
  Top 0.305: 24.7,42.6 U9.2 22.9,42.6 | 24.7,42.6 25.1,42.2 | U9.1 24.05,43.25 | 24.05,43.25 24.7,42.6 | 24.05,43.25 U9.28 24.05,44.65 23.65,45.05 C30.2 22.95,45.9 22.6,45.55 v22.6,45.4 | U9.26 25.35,42.45 25.1,42.2 | U9.21 27.95,43.25 | 27.95,43.25 v26.6,41.9 U9.TH | 27.95,43.25 U9.22 27.95,44.35 | v26,37 U9.11 U9.TH | 48.05,45.05 48.7,44.4 U8.27 48.7,42.7 48.65,42.65 | 48.05,45.05 U8.28 48.05,43.25 | 48.05,45.05 47.95,45.15 C31.2 47.31,45.9 v46.8,45.39 | U8.11 v50,37.5 | U8.1 48.05,43.25 | 48.05,43.25 48.65,42.65 | 48.65,42.65 U8.TH 51.95,43.25 | U8.21 51.95,43.25 | U8.22 51.95,43.25 | U8.2 48.6,42.6 48.65,42.65 | v74,37.4 U7.11 U7.TH | v70.6,45.4 71.1,45.9 C32.2 71.65,45.15 72.05,44.75 U7.28 72.05,43.25 | U7.1 72.05,43.25 | 72.05,43.25 72.6,42.7 | 72.6,42.7 v73.4,41.9 | v73.4,41.9 U7.TH | U7.2 72.5,42.6 72.6,42.7 | U7.27 72.7,42.8 72.6,42.7 | U7.22 75.95,43.25 | 75.95,43.25 U7.TH | U7.21 75.95,43.25 | U9.TH v25.4,40.7 | U9.TH 25.1,42.2 | v25.4,41.9 v26.6,40.7 | R66.1 8.1,44.4 v8.5,44.8 9.25,45.55 R67.1 11.15,45.55 11.4,45.3 R68.1 | R65.1 6.85,33.75 6.14,34.46 J5.5 | R63.1 10.6,28.5 v10.5,28.4 10.15,28.05 R64.1 | R62.1 v23,28.5 | R61.1 v25.6,31 | R55.1 29.05,29.55 v29,29.5 29.05,29.45 R54.1 | R60.1 25.85,32.95 | 25.85,32.95 v25.9,32.9 | R56.1 25.85,32.95 | R59.1 21.55,45.35 v21.6,45.4 | R57.1 32.55,44.95 v33.3,44.2 34.05,44.95 R58.1 | R53.1 v40.8,28.5 | R52.1 45.1,30.8 v45.5,30.4 | v44.4,33.6 44.45,33.65 R51.1 46.65,33.65 47.35,34.35 R69.1 | R50.1 43.95,40.75 v42.1,38.9 | R49.1 41.64,45.15 v41.8,44.99 | R43.1 59.54,28.29 v58.7,28.29 58.44,28.55 R44.1 | R45.1 54.4,32.15 v54.4,31.2 | R46.1 56.8,44.3 v56.2,44.9 56.7,45.4 R47.1 | R48.1 61.65,44.25 v61.6,44.2
  Top 0.305: R42.1 v71.8,28.6 | v73.8,29.5 73.75,29.55 R41.1 73.75,32.25 | R35.1 76.86,28.54 v76.9,28.5 | R34.1 79.22,28.3 v78.2,28.3 | R36.1 75.3,33.44 v75.3,32.5 75.05,32.25 73.75,32.25 | R40.1 72.9,33.1 73.75,32.25 | R39.1 68.25,45.85 v68.8,45.3 | R37.1 76.44,45.64 v76.4,45.6 | R38.1 81.86,45.44 v81.7,45.6 | R29.1 86.56,44.74 v86.3,45 | R30.1 92.04,41.94 v92.1,42 | R31.1 92.46,31.66 v92.4,31.6 | R32.1 92.54,29.96 v92.6,29.9 | R33.1 85.84,28.36 v85.9,28.3 | U7.26 73.35,41.95 v73.4,41.9
  other vias: 26,41.3 50,41.3 49.4,41.9 50.6,41.9 50.6,40.7 49.4,40.7 74,41.3 74.6,41.9 74.6,40.7 73.4,40.7
  pour Route2 (isolate 0.406, no thermals): 0.8,35.7 5.9,35.7 6.5,36.3 6.5,46.7 93.5,46.7 93.5,36.4 94.2,35.7 99.2,35.7 99.2,33.2 94.2,33.2 93.5,32.5 93.5,27.3 6.5,27.3 6.5,32.6 5.9,33.2 0.8,33.2
  pour Bottom (isolate 0.305): 40.8,45.2 53.8,45.2 53.8,41.1 51.1,38.4 46.9,38.4 46.9,41 46.1,41.8 43.6,41.8 40.8,44.6
  pour Bottom (isolate 0.305): 68.1,44.4 76.8,44.4 77.8,43.4 75.7,41.3 75.7,39.4 73.4,37.1 71.6,37.1 70.5,38.2 70.5,41.7 68.1,44.1
  pour Bottom (isolate 0.305): 20.6,44.4 27.5,44.4 28.4,45.3 32.2,45.3 32.2,42.2 30.1,40.1 30.1,38.7 28.5,37.1 24.1,37.1 22.3,38.9 22.3,42.7
BOOST_!SHDN  (via drill 0.2)
  Top 0.203: v21.55,5.86 21.21,6.21 21.1,6.21 20.83,6.48 U5.16
  Top 0.305: U3.9 61.3,14.3 v61.5,14.1 62.3,14.1 62.6,13.8 R15.1
  Bottom 0.203: v21.55,5.86 21.55,5.84 21.77,5.63 26.43,5.63 26.5,5.7 29.8,5.7 30.9,6.8 30.9,7.9 32.3,9.3 36.1,9.3 37.4,8 49.7,8 51.5,6.2 53.6,6.2 v61.5,14.1
BTN_CNT  (via drill 0.2)
  Top 0.203: U5.8 16.11,8.21 v15.7,7.8 | v10.1,10.6 v10.1,16.4
  Top 0.305: C26.1 20.5,16.9 v20.8,17.2 20.95,17.35 R20.2 R23.1
  Bottom 0.203: v15.7,7.8 10.9,7.8 10.1,8.6 v10.1,10.6 | v10.1,16.4 11.4,17.7 20.3,17.7 v20.8,17.2
BTN_SET  (via drill 0.2)
  Top 0.203: U5.7 15.71,8.71 v15.6,8.6 | v11.2,10.6 R22.2
  Top 0.305: R22.2 R21.1 13.85,17.35 14.3,16.9 C25.1
  Bottom 0.203: v15.6,8.6 13.1,8.6 11.2,10.5 v11.2,10.6
CC1  (via drill 0.2)
  Top 0.203: U5.13 19.33,6.14 v19.06,5.87
  Top 0.305: R4.2 40.3,11.9 39.7,12.5 D2.C 38,12.5 v37.6,12.1
  Bottom 0.203: v19.06,5.87 19.06,6.46 19.9,7.3 23.5,7.3 23.8,7.6 25.2,7.6 25.9,6.9 29.2,6.9 29.7,7.4 29.7,8.7 33.4,12.4 37.3,12.4 v37.6,12.1
CC2  (via drill 0.2)
  Top 0.203: U5.14 v19.83,5.87 v19.84,5.86
  Top 0.305: R5.2 40.5,14 D1.C 39.7,13.2 37.2,13.2 36.7,12.7 v36.7,11.7
  Bottom 0.203: v19.84,5.86 19.84,6.14 20.6,6.9 23.8,6.9 24.1,7.2 25,7.2 25.7,6.5 29.4,6.5 30.1,7.2 30.1,8.6 33.5,12 36.4,12 v36.7,11.7
CRG_ON  (via drill 0.2)
  Top 0.203: U5.15 20.33,6.19 v20.66,5.86 | U4.3 51.75,7.1 51.8,7.05 v51.8,6.98
  Bottom 0.203: v20.66,5.86 20.66,6.16 21,6.5 21.8,6.5 22.3,6 26.2,6 26.3,6.1 29.6,6.1 30.5,7 30.5,8.1 32.1,9.7 36.4,9.7 37.7,8.4 50.38,8.4 v51.8,6.98
D+  (via drill 0.2)
  Top 0.203: 49.15,16.15 48.8,15.8 U1.3 | 49.15,16.15 49.75,16.15 50.15,16.55 J1.A6 | J1.B6 49.15,16.15
  Top 0.305: U1.3 48.8,14.9 v48.5,14.6
  Bottom 0.305: R26.2 46.8,12.9 v48.5,14.6
D-  (via drill 0.2)
  Top 0.203: U1.2 51,15.9 50.65,16.25 J1.B7 50.65,18.45 50.5,18.6 49.8,18.6 49.65,18.45 J1.A7
  Top 0.305: v51.2,14.8 51,15 U1.2
  Bottom 0.305: R25.2 46.5,10.6 50.7,14.8 v51.2,14.8
FBX  (via drill 0.2)
  Top 0.305: R10.1 92.15,23.7 v91.3,23.7 C19.1 | U3.2 61.3,21.1 60.9,21.5 v60.9,22.1 | R14.2 60.85,22.15 v60.9,22.1 | R11.2 60.95,22.15 v60.9,22.1
  Bottom 0.406: v60.9,22.1 60.9,23.7 61.6,24.4 90.6,24.4 v91.3,23.7
GATE
  Top 0.305: U3.7 60.33,13.53 60.09,13.29 R7.1
GND  (via drill 0.2, 0.3)
  Top 0.203: U5.36 17.83,13.27 16.85,14.25 C5.2 | U5.5 15.29,9.71 v15,10 | 22.1,6.3 21.9,6.3 21.39,6.81 U5.17 | 22.1,6.3 23.6,6.3 23.9,6.6 C8.2 | U5.18 21.83,6.57 22.1,6.3 | U5.26 23.51,11.21 24.58,12.28 C4.2 25.88,12.28 v25.9,12.3 | U6.5 29.05,10.15 28.32,10.88 C6.2 | U3.5 59.8,17.9 60.1,17.6 U3.EP | U4.5 52.25,9.05 52.3,9 U4.TP | U5.EP 21.4,8.14 v21.4,8.1
  Top 0.254: Y1.2 14.7,12 v15,11.7
  Top 0.305: v87.3,23.4 87.3,23.45 87.55,23.7 C19.2 | R20.1 v21.5,20 | C25.2 v17.35,16.9 C26.2 | C29.2 v11,7.1 | C23.2 v11,9.1 | v16.9,15.7 16.9,14.95 C5.2 | R22.1 v11.2,20.1 | C8.2 v24.6,6.6 | v39.41,17.2 39.3,17.2 C24.2 | C1.2 39.4,17.43 v39.41,17.2 | R3.1 39.9,16.2 39.4,16.7 v39.41,17.2 | U2.2 v40.8,7.2 40.8,8.5 41.75,9.45 C3.2 | D2.A 38.5,14.3 v38.8,14.6 38.9,14.7 D1.A | R1.1 45.95,15.75 v46,15.8 | v67,23.3 66.45,23.85 C9.2 C10.2 R11.1 R14.1 C13.2 56.95,23.85 v56.9,23.9 | R24.1 v17.3,24.5 | C2.2 v44.6,9.4 R2.1 | C7.2 33.6,23.8 v33.9,24.1
  Top 0.508: J1.B1 46.7,16.4 | J1.A1 53.1,16.7 53.9,15.9 54.6,15.9 v54.9,16.2
  Top 0.61: 46.7,16.4 v46.6,16.3 | v46.6,16.3 v46.6,15.3 46.1,15.8 | v46.6,16.3 46.1,15.8 | v46,15.8 46.1,15.8
  Bottom 0.305: v33.9,24.1 BT1.- 36.05,22.9 S3.1
  other vias: 67.9,21.8 70.1,21.8 69,21.8 67.9,19.3 70.1,19.3 69,19.3 27.69,10.88 26.4,17.3 51,13.65 53.5,14.8 92.3,5.6 90.3,5.6 91.3,5.6 92.3,12.5 93.2,12.5 18.2,11.3 21.4,11.3 18.2,8.1
  pour Route2 (isolate 0.406, no thermals): 0.8,13.7 5.9,13.7 6.5,14.3 6.5,24.7 93.5,24.7 93.5,14.4 94.2,13.7 99.2,13.7 99.2,11.2 94.2,11.2 93.5,10.5 93.5,5.3 6.5,5.3 6.5,10.6 5.9,11.2 0.8,11.2
  pour Top (no thermals): 66.5,17.4 64.5,17.4 64,16.9 59.4,16.9 57.3,14.8 57.3,13.4 57,13.1 57,10.1 56.8,9.9 56.8,5.6 53.3,5.6 53.3,8.3 52.9,8.7 50.8,8.7 50.8,9.3 52.7,9.3 53.1,9.7 53.1,13.4 58,18.3 64.9,18.3 65.1,18.5 66.5,18.5
  pour Top (no thermals): 67.6,22 70.4,22 70.4,19.1 67.6,19.1
  pour Top (no thermals): 53.1,13.4 53.1,16.3 52.9,16.5 52.9,16.7 56.4,16.7
  pour Top (no thermals): 93.1,14.6 94,13.7 99.2,13.7 99.2,11.2 94.2,11.2 93.8,10.8 92,10.8 92,12.7 91.6,13.1 90.1,13.1 90.1,14.6
  pour Top: 89.7,7 89.7,5.8 90.2,5.3 92.4,5.3 92.9,5.8 92.9,7
H_B  (via drill 0.2)
  Top 0.305: U9.19 29.75,41.95 v29.8,42
  Route15 0.305: v14.6,39.6 15.3,40.3 16.8,40.3 17.5,39.6 18.6,39.6 19.6,40.6 20.8,40.6 21.3,40.1 21.3,39 21.9,38.4 23,38.4 24.3,39.7 26.9,39.7 29.2,42 v29.8,42 30.4,42 31.8,40.6 32.4,40.6 33.4,39.6 v34.6,39.6
  Bottom 0.305: R81.2 v14.6,39.6 | R78.2 v34.6,39.6
H_G  (via drill 0.2)
  Top 0.305: U9.17 28.87,40.69 v29.7,40.69
  Route15 0.305: v16,38.9 16,38.8 19.1,35.7 22,35.7 22.8,36.5 22.8,36.8 24.6,38.6 27.61,38.6 v29.7,40.69 30.3,40.09 30.3,38.8 31.13,37.97 32.1,37.97 33.17,36.9 34.6,36.9 37.3,39.6 v37.4,39.6
  Bottom 0.305: R80.2 17.25,38.9 v16,38.9 | R77.2 v37.4,39.6
H_R  (via drill 0.2)
  Top 0.305: U9.18 30.2,41.3 v30.34,41.16
  Route15 0.305: v14.3,35 15.2,35.9 15.2,39.3 15.6,39.7 16.3,39.7 17.7,38.3 19,38.3 19.3,38 21.3,38 21.5,37.8 23.1,37.8 24.4,39.1 27.1,39.1 29.36,41.36 30.14,41.36 v30.34,41.16 30.8,40.7 30.8,39 31.4,38.4 v33,38.4
  Bottom 0.305: R79.2 14.95,35 v14.3,35 | v33,38.4 32.9,38.4 32.7,38.2 32.7,36.5 34,35.2 R76.2
HV_170VDC
  pour Top (no thermals): 92.8,22.1 92.8,20.8 93.2,20.4 93.2,19.1 94,18.3 98.8,18.3 98.8,16.8 93.6,16.8 93.3,17.1 90.2,17.1 90.2,18.4 91.2,18.4 91.7,18.9 91.7,20.5 92,20.8 92,22.1
JTCK  (via drill 0.2)
  Top 0.203: U5.28 21.83,14.33 24.1,16.6 24.16,16.6 24.56,17 v24.9,17
  Bottom 0.203: TCK.TP v24.9,17
JTDI  (via drill 0.2)
  Top 0.203: U5.29 21.33,14.93 22.5,16.1 v22.66,16.1
  Bottom 0.203: v22.66,16.1 TDI.TP
JTDO  (via drill 0.2)
  Top 0.203: U5.30 20.83,13.63 20.9,13.7 20.9,15.1 21.9,16.1 v21.9,16.3
  Bottom 0.203: TDO.TP v21.9,16.3
JTMS  (via drill 0.2)
  Top 0.203: U5.25 22.22,10.71 22.03,10.9 22.03,11.85 22.28,12.09 22.29,12.09 22.3,12.1 22.3,14.1 23.6,15.4 25,15.4 TMS.TP
  other vias: 25.6,16
LX
  pour Top (no thermals): 39.7,6.4 39,7.1 35.5,7.1 35.5,6 39.7,6
M_B  (via drill 0.2)
  Top 0.305: U9.16 29.6,40 29.7,39.9 29.7,38.96 v29.54,38.8
  Route15 0.305: v29.54,38.8 29.9,38.44 29.9,36.5 30.4,36 39.7,36 39.9,35.8 44.8,35.8 45.3,35.3 55,35.3 57.9,38.2 60.8,38.2 61.6,39 v61.6,39.4 62.5,40.3 64.8,40.3 66.9,38.2 70.3,38.2 72.8,35.7 79.5,35.7 79.7,35.9 80.9,35.9 82.6,37.6 v82.6,39.6
  Bottom 0.305: R70.2 v82.6,39.6 | R75.2 61.95,39.4 v61.6,39.4
M_G  (via drill 0.2)
  Top 0.305: U9.14 27.95,37.85 v28.2,37.6
  Route15 0.305: v28.2,37.6 28.3,37.6 28.8,37.1 28.8,35.3 30.7,33.4 32.4,33.4 33.3,34.3 36,34.3 37.2,33.1 37.2,32 37.5,31.7 44.5,31.7 47.1,34.3 57,34.3 58,33.3 60.3,33.3 62.1,35.1 63.7,35.1 | 63.7,35.1 64,35.1 | v64,39.1 64,35.4 | 64,35.1 64,35.4 | 64,35.1 64.3,35.1 | 64.3,35.1 65.1,34.3 66.8,34.3 68,33.1 73.3,33.1 74.8,31.6 82.2,31.6 82.7,32.1 83,33.3 83,34.3 84.3,35.6 84.3,38.6 v85.3,39.6 | 64,35.4 63.7,35.1 | 64,35.4 64.3,35.1
  Bottom 0.305: R71.2 v85.3,39.6 | R74.2 65.05,39.1 v64,39.1
M_R  (via drill 0.2)
  Top 0.305: U9.15 28.82,38.38 v29,38.2
  Route15 0.305: v29,38.2 29.4,37.8 29.4,36.3 30.13,35.57 32.83,35.57 33.1,35.3 36,35.3 37,34.3 38.7,34.3 40.3,32.7 44.7,32.7 46.8,34.8 57.7,34.8 58.7,35.8 60.9,35.8 v61,35.9 62.8,37.7 62.8,39.1 63.5,39.8 64.4,39.8 64.7,39.5 64.7,38 66.9,35.8 71.6,35.8 74.2,33.2 80.2,33.2 82,35 v82.3,35
  Bottom 0.305: R72.2 82.5,35.2 v82.3,35 | v61,35.9 61.7,35.2 R73.2
MCU_RX  (via drill 0.2, 0.3)
  Top 0.203: U5.10 17.83,6.63 17.4,6.2 v17.3,6.2 | v24.5,10.3 24.9,10.3 25.56,10.96 26.06,10.96 27,11.9 29.68,11.9 J6.8
  Bottom 0.203: v17.3,6.2 18.3,7.2 19,7.2 21.8,10 24.2,10 v24.5,10.3
MCU_TX  (via drill 0.2)
  Top 0.203: U5.9 16.51,7.71 16.1,7.3 v16.1,6.5 | v24.31,11.11 24.5,11.3 25.9,11.3 26.9,12.3 26.9,13.8 27.7,14.6 29.4,14.6 29.9,15.1 29.9,19.74 J6.1
  Bottom 0.203: v16.1,6.5 16.1,7.1 19.41,10.41 23.61,10.41 v24.31,11.11
N$1  (via drill 0.2, 0.35)
  Top 0.305: C1.1 R3.2 41.99,16.16 | J1.SHT4 45.57,21.89 43.98,20.3 | C1.1 43.94,20.26 43.98,20.3 | J1.SHB2 54.21,20.4 v54.11,20.3 54.11,18.28 J1.SHT1 | C1.1 45.47,18.29 J1.SHB3 | v45.58,20.3 43.98,20.3
  Bottom 0.305: v54.11,20.3 v45.58,20.3 | J1.SHB3 v45.58,20.3 | J1.SHB2 54.21,20.4 v54.11,20.3 | J1.SHT1 54.22,20.19 v54.11,20.3 | v45.58,20.3 J1.SHT4
N$2  (via drill 0.2, 0.3)
  Top 0.203: v48.3,16.36 48.15,16.51 J1.B5
  Top 0.305: v46,14.1 44.65,14.1 R1.2 42.9,14.05 R5.1
  Bottom 0.305: v48.3,16.36 48.3,15.56 46.84,14.1 v46,14.1
N$3  (via drill 0.2, 0.3)
  Top 0.203: v51.4,16.36 51.15,16.61 J1.A5
  Top 0.305: v46,12 44.65,12 R2.2 42.9,11.95 R4.1
  Bottom 0.305: v51.4,16.36 47.04,12 v46,12
N$4
  pour Top (no thermals): 78.1,6.9 79.9,8.7 80.6,8.7 80.6,6 78.5,6 78.1,6.4
N$5
  pour Top (no thermals): 46.4,11.2 46.4,7.9 47.3,7.9 47.3,11.2
N$6
  Top 0.305: Q1.4 60.98,6.38 61.3,6.7 61.3,11.2 61.8,11.7 R7.2
N$7
  pour Top (no thermals): 86.1,21.2 89.7,21.2 90.6,20.3 90.6,19.7 86.1,19.7
N$8
  Top 0.305: C9.1 65.9,21.4 65.75,21.25 R8.1
N$9
  pour Top (no thermals): 60.7,7.4 57.7,7.4 57.7,9.9 57.8,10 57.8,11 60.7,11
N$10
  pour Top (no thermals): 61.9,10.4 61.9,5.3 75.3,5.3 75.3,6.9 72.2,6.9 70.4,8.7 70.4,13.8 67.6,13.8 67.6,12.1 63,12.1 63,11.5
N$11
  Top 0.203: U4.6 51.75,11.26 C21.1
N$12  (via drill 0.2)
  Top 0.203: U5.4 15.99,10.21 v15.9,10.3 | v23,13.9 24,14.9 26.2,14.9 26.5,14.6 v26.7,14.6 | v36.7,15.68 36.7,17.14 C24.1
  Top 0.305: R17.2 36.74,19.52 R16.1 C24.1
  Bottom 0.203: v15.9,10.3 18.7,10.3 22.3,13.9 v23,13.9 | v36.7,15.68 34.38,15.68 33.3,14.6 v26.7,14.6
N$13
  Top 0.305: N1.0 89.64,40.9 T3.3
N$14
  Top 0.305: T41.3 51.27,33.6 J7.2
N$15
  Top 0.305: T41.2 49.92,35.3 R69.2
N$16  (via drill 0.2)
  Top 0.305: v53.8,42 53.75,41.95 U8.19 | T41.1 51.7,35.77 v51.7,36
  Bottom 0.305: v51.7,36 51.7,38.9 53.8,41 v53.8,42
N$17  (via drill 0.2)
  Top 0.203: U5.24 23.49,10.21 24,9.7 25.39,9.7 25.99,10.31 v26.19,10.31
  Bottom 0.203: v26.19,10.31 26.29,10.21 30.11,10.21 33.1,13.2 39,13.2 39.3,12.9 R26.1
N$18
  Top 0.305: S2.1 23.5,20.98 R23.2
N$19
  Top 0.203: U5.3 16.39,10.71 16.2,10.9 14.7,10.9 14.6,10.8 Y1.3
N$20
  Top 0.203: R21.2 13.65,19.05 14.8,17.9 18.7,17.9 18.9,17.7 18.9,16.1 17.9,15.1 17.9,13.9 18.33,13.47 U5.35
  Top 0.305: R24.2 16.35,22.05 16.16,22.25 S1.1 13.2,20.98 R21.2
N$21  (via drill 0.2)
  Top 0.305: v39.46,21.3 R17.1
  Bottom 0.305: S3.2 41.27,21.3 v39.46,21.3
N$22
  Top 0.203: U5.2 16.39,11.21 14.4,13.2 Y1.1
N$23  (via drill 0.2)
  Top 0.203: U5.23 23.39,9.71 23.8,9.3 26,9.3 v26.2,9.5
  Bottom 0.203: v26.2,9.5 26.4,9.7 30.1,9.7 33.2,12.8 38.3,12.8 40.5,10.6 R25.1
N$24
  Top 0.305: N1.9 89.3,37 89.54,37.24 T4.3
N$25
  Top 0.305: N1.8 88.11,33.99 88.58,33.52 T5.3
N$26
  Top 0.305: N1.7 87.21,32.89 87.88,32.22 T2.3
N$28
  Top 0.305: T6.3 84.48,31.77 N1.6
N$29  (via drill 0.2)
  Top 0.203: U6.1 31.25,7.45 31.3,7.4 v31.6,7.4
  Bottom 0.203: BT1.+ 33.6,7.4 v31.6,7.4
N$30
  Top 0.305: T7.3 81.18,32.89 N1.5
N$31
  Top 0.305: T8.3 79.89,34.04 N1.4
N$32
  Top 0.305: T9.3 79.25,36.62 N1.3
N$33
  Top 0.305: N1.2 79.89,40.59 79.98,40.68 T10.3
N$34
  Top 0.305: N1.1 81.62,42.42 81.9,42.7 T11.3
N$35
  Top 0.305: T3.2 88.99,44.71 R29.2
N$36
  Top 0.305: T11.2 84.27,45.37 R38.2
N$37
  Top 0.305: T10.2 79.33,44.87 79.12,45.08 R37.2
N$38
  Top 0.305: T9.2 75.47,35.31 R36.2
N$39
  Top 0.305: T8.2 76.9,32.26 76.9,31.42 R35.2
N$40
  Top 0.305: T7.2 80.73,29.47 80.96,29.24 R34.2
N$41
  Top 0.305: T6.2 82.64,28.79 R33.2
N$42
  Top 0.305: T2.2 89.66,29.84 R32.2
N$43
  Top 0.305: T5.2 91.09,34.3 R31.2
N$44
  Top 0.305: T4.2 92.06,39.2 R30.2
N$45
  Top 0.305: N3.0 41.3,40.56 T23.3
N$46
  Top 0.305: N3.9 40.95,37.2 T24.3
N$47
  Top 0.305: N3.8 40.14,34.6 T25.3
N$48
  Top 0.305: N3.7 38.84,32.42 T26.3
N$49
  Top 0.305: N3.6 36.2,32.05 T27.3
N$50
  Top 0.305: N3.5 33.2,32.46 T28.3
N$51
  Top 0.305: N3.4 31.32,34.06 T29.3
N$52
  Top 0.305: N3.3 30.32,36.08 T30.3
N$53
  Top 0.305: N3.2 31.5,39.76 T31.3
N$54
  Top 0.305: N3.1 33.77,41.26 T32.3
N$55
  Top 0.305: N2.0 68.5,39.76 T13.3
N$56
  Top 0.305: N2.9 70.33,37 T14.3
N$57
  Top 0.305: T15.3 69.61,33.12 N2.8
N$58
  Top 0.305: T16.3 67.2,32.06 N2.7
N$59
  Top 0.305: T17.3 64.33,31.93 N2.6
N$60
  Top 0.305: T18.3 60.73,31.99 N2.5
N$61
  Top 0.305: N2.4 59.76,34.5 T19.3
N$62
  Top 0.305: T20.3 59.08,37.17 N2.3
N$63
  Top 0.305: T21.3 59.69,39.57 N2.2
N$64
  Top 0.305: N2.1 62.94,41.11 T22.3
N$65
  Top 0.305: T13.2 67.85,43.05 67.3,43.6 R39.2
N$66
  Top 0.305: T22.2 63.45,44.55 63.35,44.65 R48.2
N$67
  Top 0.305: T21.2 59.04,44.34 59.15,44.45 R47.2
N$68
  Top 0.305: R46.2 56.8,41.05 56.35,40.6 T20.2
N$69
  Top 0.305: R45.2 56.35,33.42 T19.2
N$70
  Top 0.305: R44.2 58.05,30.25 58.65,30.85 T18.2
N$71
  Top 0.305: R43.2 62,28.4 62.48,28.88 T17.2
N$72
  Top 0.305: T16.2 68.28,29.48 R42.2
N$73
  Top 0.305: T15.2 72.03,31.27 R41.2
N$74
  Top 0.305: T14.2 71.88,34.88 72.15,35.15 R40.2
N$75
  Top 0.305: T23.2 40.65,43.1 R49.2
N$76
  Top 0.305: T32.2 35.62,44.42 35.75,44.55 R58.2
N$77
  Top 0.305: T31.2 R57.2
N$78
  Top 0.305: R56.2 27.7,35.35 T30.2
N$79
  Top 0.305: T29.2 29.65,32.55 30.75,31.45 R55.2
N$80
  Top 0.305: R54.2 31.1,28.4 32,27.5 33.2,27.5 33.85,28.15 T28.2
N$81
  Top 0.305: T27.2 37.12,28.98 37.6,28.5 R53.2
N$82
  Top 0.305: T26.2 41.77,30.57 42,30.8 R52.2
N$83
  Top 0.305: T25.2 44.35,35.25 44.45,35.35 R51.2
N$84
  Top 0.305: T24.2 44.3,37.92 R50.2
N$85
  Top 0.305: N4.0 20.7,39.96 T1.3
N$86
  Top 0.305: N4.9 22.61,37 T12.3
N$87
  Top 0.305: N4.8 21.2,33.53 T33.3
N$88
  Top 0.305: N4.7 18.73,32.54 T34.3
N$89
  Top 0.305: T35.3 16.48,31.77 N4.6
N$90
  Top 0.305: T36.3 13.62,32.75 N4.5
N$91
  Top 0.305: T37.3 11.79,34.53 N4.4
N$92
  Top 0.305: T38.3 11.16,36.91 N4.3
N$93
  Top 0.305: T39.3 11.89,39.5 N4.2
N$94
  Top 0.305: N4.1 14.59,41.11 T40.3
N$95
  Top 0.305: T1.2 19.72,42.9 R59.2
N$96
  Top 0.305: T40.2 14.54,45.11 R68.2
N$97
  Top 0.305: T39.2 10.12,42.98 9.72,43.38 R67.2
N$98
  Top 0.305: T38.2 8.7,39.1 8.12,39.68 R66.2
N$99
  Top 0.305: T37.2 8.56,33.7 R65.2
N$100
  Top 0.305: T36.2 10.23,31.16 9.48,30.41 R64.2
N$101
  Top 0.305: T35.2 14.34,28.84 14.02,28.52 R63.2
N$102
  Top 0.305: T34.2 19.4,28.9 19.8,28.5 R62.2
N$103
  Top 0.305: R61.2 22.27,31.68 T33.2
N$104
  Top 0.305: T12.2 24.41,35.03 R60.2
N$105  (via drill 0.2)
  Top 0.305: D5.4 85.7,36 v85.7,35.2
  Bottom 0.305: R72.1 v85.7,35.2
N$106  (via drill 0.2)
  Top 0.305: D5.3 86.4,37.8 v86.6,37.6
  Bottom 0.305: R71.1 86.05,37.05 v86.6,37.6
N$107  (via drill 0.2)
  Top 0.305: D5.2 81.6,37.8 v81.4,37.6
  Bottom 0.305: R70.1 81.95,37.05 v81.4,37.6
N$108  (via drill 0.2)
  Top 0.305: D8.4 17.7,36 v17.7,35.2
  Bottom 0.305: R79.1 v17.7,35.2
N$109  (via drill 0.2)
  Top 0.305: D8.3 18.4,37.8 v18.6,37.6
  Bottom 0.305: R80.1 18.05,37.05 v18.6,37.6
N$110  (via drill 0.2)
  Top 0.305: D8.2 13.6,37.8 v13.4,37.6
  Bottom 0.305: R81.1 13.95,37.05 v13.4,37.6
N$111  (via drill 0.2)
  Top 0.305: D6.4 65.7,36 v65.7,35.2
  Bottom 0.305: R73.1 v65.7,35.2
N$112  (via drill 0.2)
  Top 0.305: D6.3 66.4,37.8 v66.6,37.6
  Bottom 0.305: R74.1 66.05,37.05 v66.6,37.6
N$113  (via drill 0.2)
  Top 0.305: D6.2 61.6,37.8 v61.4,37.6
  Bottom 0.305: R75.1 61.95,37.05 v61.4,37.6
N$114  (via drill 0.2)
  Top 0.305: D7.2 33.6,37.8 v33.4,37.6
  Bottom 0.305: R78.1 33.95,37.05 v33.4,37.6
N$115  (via drill 0.2)
  Top 0.305: D7.3 38.4,37.8 v38.6,37.6
  Bottom 0.305: R77.1 38.05,37.05 v38.6,37.6
N$116  (via drill 0.2)
  Top 0.305: D7.4 37.5,35.5 v37.8,35.2
  Bottom 0.305: R76.1 v37.8,35.2
NJTRST  (via drill 0.2)
  Top 0.203: U5.31 20.33,13.73 20.5,13.9 20.5,15.6 v20.7,15.8
  Bottom 0.203: RST.TP v20.7,15.8
RT
  Top 0.305: U3.4 60.3,20.67 60.1,20.87 58.17,20.87 57.9,20.6 R9.2
RTC!INT  (via drill 0.2)
  Top 0.203: U5.12 18.83,6.43 v18.3,5.9 | U6.3 32.6,9.25 R27.1 32.75,6.75 v32,6
  Bottom 0.203: v18.3,5.9 18.3,5.83 18.83,5.3 31.3,5.3 v32,6
RTCCLK  (via drill 0.2)
  Top 0.203: U5.11 18.33,7.33 18.5,7.5 22,7.5 22.2,7.3 23.8,7.3 24,7.5 v26.1,7.5 | U6.7 28.55,8.35 v28.3,8.1
  Bottom 0.203: v28.3,8.1 28.2,8.1 27.6,7.5 v26.1,7.5
SCL  (via drill 0.2)
  Top 0.203: U5.33 19.33,14.47 v19.2,14.6 | U6.8 27.95,7.45 27.3,8.1 v27.2,8.1
  Top 0.305: R18.1 6.4,13.1 5.79,13.75 3.29,13.75 J3.3
  Bottom 0.203: J3.3 3.3,16.3 5.9,16.3 8.3,13.9 18.5,13.9 v19.2,14.6 19.4,14.8 24.2,14.8 24.8,14.2 24.8,11.4 25.1,11.1 25.1,8.9 25.9,8.1 v27.2,8.1
SDA  (via drill 0.2)
  Top 0.203: U5.34 18.83,13.57 18.5,13.9 v18.5,14.9 | U6.2 31.85,8.35 32.2,8 32.2,7 32,6.8 27.7,6.8 26.1,8.4 v26.1,8.7
  Top 0.305: R19.1 6,16.9 5.36,17.54 J3.2
  Bottom 0.203: J3.2 5.44,17.54 8.68,14.3 17.9,14.3 v18.5,14.9 18.8,15.2 24.9,15.2 25.2,14.9 25.2,11.6 25.5,11.3 25.5,9.3 v26.1,8.7
SENSE
  Top 0.305: U3.6 59.8,14.4 59.54,14.14 C16.1 58.6,13.5 58.2,13.1 R13.1
SS
  Top 0.305: U3.3 60.8,20.8 60.3,21.3 58.1,21.3 57.9,21.5 C13.1
SUP_BOOST  (via drill 0.2)
  Top 0.305: U3.8 60.8,16 60.9,16.1 62,16.1 62.48,15.62 | 62.48,15.62 C14.1 | U3.10 62.06,15.2 62.48,15.62 | R15.2 v66,13.8 | C20.1 65.8,15 v66,14.8
  other vias: 50.1,10.1 50.1,11 50.8,11.6 92.5,9.7 91.3,9.7 90,9.7 89.3,11.4
  pour Top (no thermals): 92.8,8 87.4,8 85.4,6 81.6,6 81.6,8.7 83.4,8.7 85.9,11.2 85.9,13.7 88.5,13.7 88.5,13.1 89.7,11.9 91.1,11.9 91.1,10.2 91.3,10 92.8,10
  pour Top (no thermals): 64.6,13.4 64.6,14.6 64,15.2 63.3,15.2 63.3,16 64.7,16 65.2,16.5 66.4,16.5 66.4,13.4
  pour Top (no thermals): 51.25,9.8 51.25,10.5 51.1,10.7 51,10.8 51,11.8 50.4,11.8 49.9,11.3 49.9,9.8
  pour Route15 (isolate 0.406): 93.5,5.3 93.5,24.7 57.2,24.7 57.2,17.3 52.5,12.6 50.2,12.6 49.3,11.7 49.3,5.3
U_!OE  (via drill 0.2)
  Top 0.305: U9.20 29.5,42.6 29.8,42.9 29.8,43.6 29.1,44.3 v29.1,45.1 | v53.9,43.1 53.9,42.98 53.52,42.6 U8.20 | v77.8,43.9 77.9,43.8 77.9,42.9 77.6,42.6 U7.20
  Bottom 0.305: J5.3 5.1,37 7.7,39.6 7.7,45.2 8.1,45.6 20.1,45.6 21,44.7 27.3,44.7 28.2,45.6 28.8,45.6 | 29.1,45.6 29.4,45.6 | 29.4,45.6 45.6,45.6 46.5,44.7 51.9,44.7 52.87,45.67 53.63,45.67 | v77.8,43.9 77.1,44.6 67.4,44.6 66.33,45.67 54.17,45.67 | 54.17,45.67 53.9,45.67 | 53.9,45.67 53.63,45.67 | v53.9,43.1 53.9,45.4 | 53.9,45.67 53.9,45.4 | 53.63,45.67 53.9,45.4 | 53.9,45.4 54.17,45.67 | 28.8,45.6 29.1,45.6 | v29.1,45.1 29.1,45.3 | 29.1,45.3 29.1,45.6 | 28.8,45.6 29.1,45.3 | 29.4,45.6 29.1,45.3
U_SCL  (via drill 0.2)
  Top 0.305: v75.3,46 U7.23 | U8.23 51.3,44.6 52.1,45.4 v52.1,45.9 | U9.23 27.3,45.7 v27.4,45.8
  Bottom 0.305: J5.4 3.2,38.25 5.4,38.25 6.3,39.1 7.1,39.9 7.1,45.5 7.7,46.1 25.8,46.1 26.1,45.8 v27.4,45.8 27.7,46.1 50.8,46.1 51,45.9 v52.1,45.9 52.3,46.1 74.14,46.1 74.25,45.99 74.85,45.99 74.86,46 v75.3,46
U_SDA  (via drill 0.2)
  Top 0.305: U7.24 74.65,46.55 v74.6,46.6 | U8.24 50.65,44.75 51.4,45.5 v51.4,46.6 | v26.5,46.6 26.65,46.45 U9.24
  Bottom 0.305: J5.1 6.5,41.5 6.5,45.8 7.3,46.6 v26.5,46.6 v51.4,46.6 v74.6,46.6
V+  (via drill 0.2)
  Top 0.305: C30.1 25.38,45.77 24.7,45.09 U9.27 | C30.1 25.35,45.6 26,44.97 U9.25 | U8.25 50,45.1 v49.7,45.4 | U8.26 49.35,45.05 v49.7,45.4 | C31.1 49.7,45.85 v49.7,45.4 | U7.25 74,45.07 v73.7,45.37 73.7,45.55 C32.1 | C30.1 25.35,45.51 v25.3,45.47 | D7.1 35.3,35.4 35.3,34.3 34.8,33.8 v34.8,30.4 | D8.1 14.5,35.9 15.2,35.2 v15.2,34 | D6.1 62.5,35.9 63.2,35.2 v63.2,34 | D5.1 82.5,35.9 v84.5,33.9
  Route15 0.305: v63.2,34 63.2,33.47 62.5,31.6
  Route15 0.406: v49.7,45.4 49.7,44.5 | 49.7,44 49.7,44.5 | 49.7,44.5 49.2,44 | 49.7,44.5 50.1,44.1 50.1,44 | v25.3,45.47 25.3,44.7 | 25.3,44.7 25.3,44.2 | 25.3,44.7 24.8,44.2 | 25.3,44.7 25.8,44.2 | 6.6,41 8.5,39.1 8.5,37.4 10.3,35.6 11,35.6 12.2,36 12.8,36 13.5,35.3 13.5,34.8 14,34.3 14.9,34.3 v15.2,34 16.2,34 17,33.2 17.5,31.7 18.1,31.1 19,31.1 19.7,31.8 32.5,31.8 33.9,30.4 v34.8,30.4 37.6,30.4 38.5,29.5 43.1,29.5 47.4,33.8 55.2,33.8 57.4,31.6 62.5,31.6 63.8,30.3 76.9,30.3 77.6,31 79.9,31 80.9,30 84.9,30 85.6,30.7 85.6,31.4 84.9,33.5 v84.5,33.9
  Route15 0.61: v73.7,45.37 73.7,44.7 73.3,44.3 67.6,44.3 66.8,45.1 59.4,45.1 58.3,44 50.1,44 49.7,44 49.2,44 40.3,44 39.1,45.2 31.93,45.2 30.93,44.2 25.8,44.2 25.3,44.2 24.8,44.2 21.5,44.2 20.5,45.2 10.8,45.2 6.6,41 3.46,41 J5.2
VBUS
  Top 0.305: U1.4 47.55,13.45 47.5,13.5
  Top 0.508: J1.B4 47.5,13.5 47.5,12.8 48.75,11.55 49.7,12.5 52,12.5 52.3,12.8 J1.A4
  Top 0.813: 48.75,11.55 L1.2
VC
  Top 0.305: U3.1 61.8,20.4 61.9,20.5 R8.2 64.05,21.2 63.9,21.35 C10.1

## Text on the board
tNames: JLCJLCJLCJLC
bNames: RISC-V powered / Nixie-Tube Clock / By / gfcwfzkm / (05.2021)